# Altium project E-Last.PrjPcb
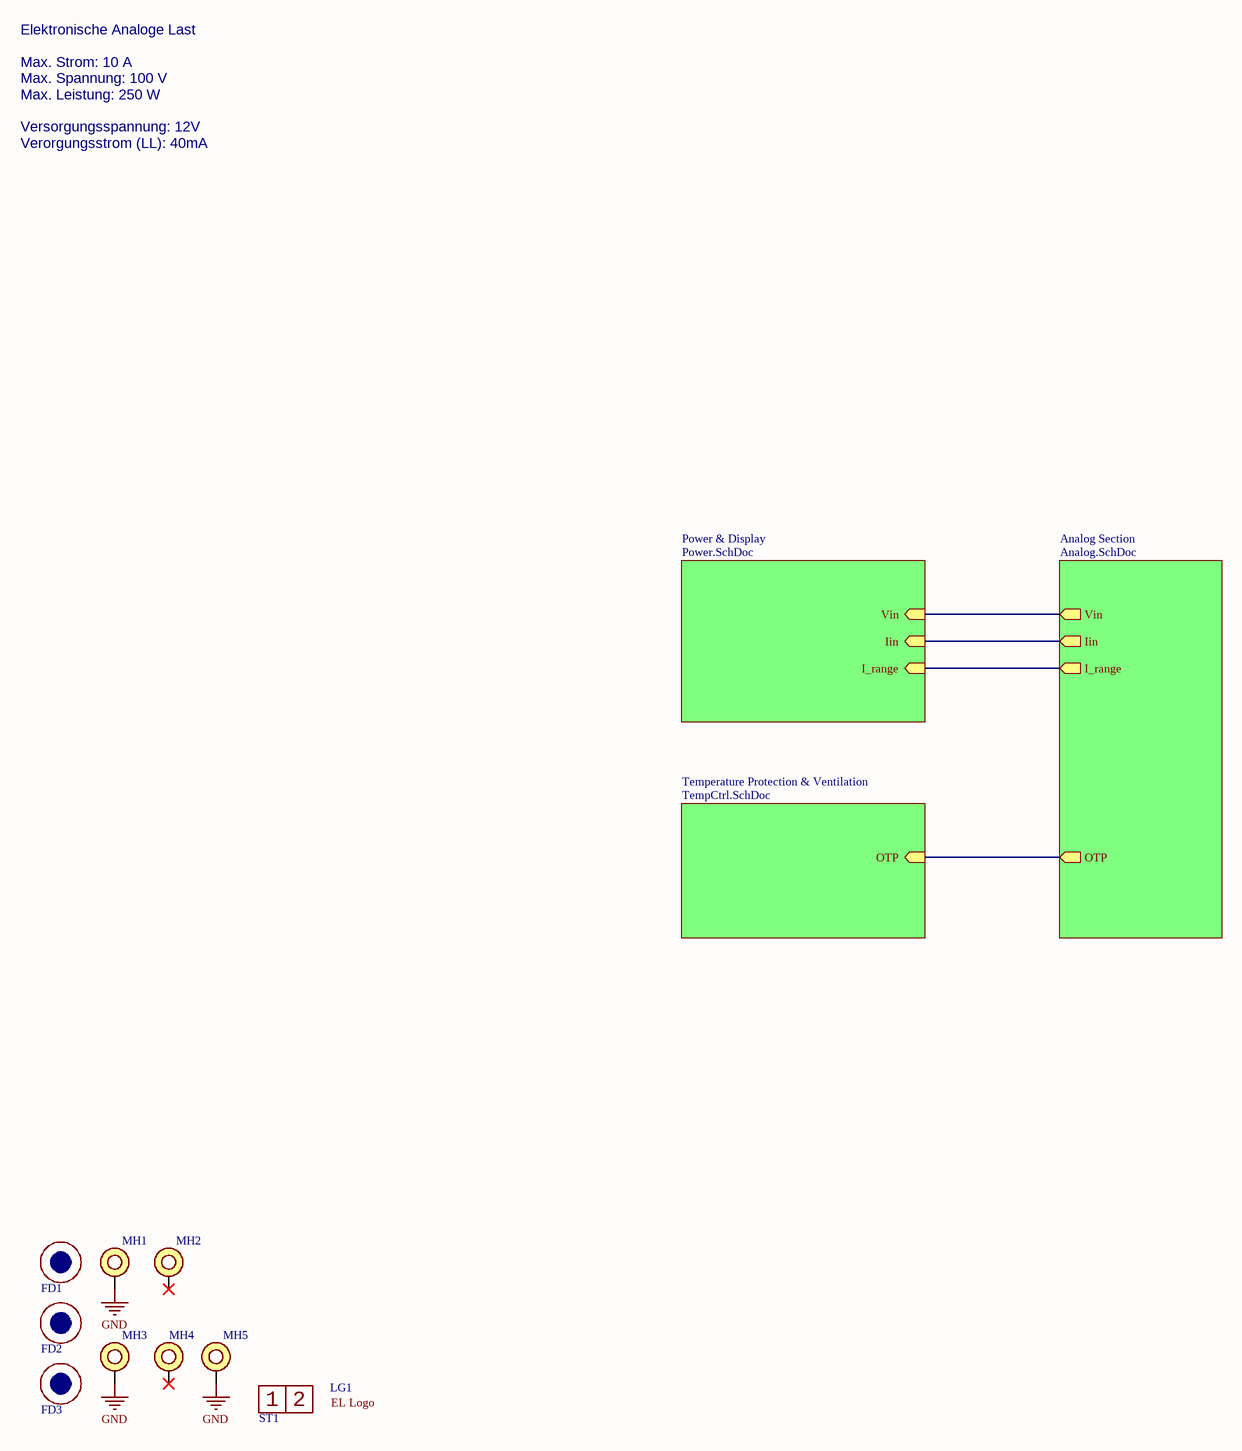
[diagram p0: Main.SchDoc]
Designer: ElektronikLabor; PCBDate: 16.12.2019; Revision: 1.1; SchematicDate: 16.12.2019; SheetTotal: 4; Title: E-Last
4 sheets, 168 parts. Net scope: hierarchical (ports join the sheet entries above them; power ports are global).
Sheets:
  Main.SchDoc
    Power & Display = Power.SchDoc
    Analog Section = Analog.SchDoc
    Temperature Protection & Ventilation = TempCtrl.SchDoc

## Sheet Main.SchDoc: E-Last
size A3; Organization: ElektronikLabor; Revision: 1.1; SheetNumber: 1; SheetTotal: 4; Designer: ElektronikLabor; SchematicDate: 16.12.2019; SheetName: Overview

### Parts
FD1  Fiducial Mark 1mm  [Mech Fiducial 1mm]  (value not drawn)  (no BOM)
FD2  Fiducial Mark 1mm  [Mech Fiducial 1mm]  (value not drawn)  (no BOM)
FD3  Fiducial Mark 1mm  [Mech Fiducial 1mm]  (value not drawn)  (no BOM)
LG1  EL Logo  [Mech Logo EL]  (no BOM)
MH1  3.4mm  [Mech Hole 3.4mm Plated & Restring]  (value not drawn)  (no BOM)
MH2  3.4mm  [Mech Hole 3.4mm Plated & Restring]  (value not drawn)  (no BOM)
MH3  3.4mm  [Mech Hole 3.4mm Plated & Restring]  (value not drawn)  (no BOM)
MH4  3.4mm  [Mech Hole 3.4mm Plated & Restring]  (value not drawn)  (no BOM)
MH5  3.4mm  [Mech Hole 3.4mm Plated & Restring]  (value not drawn)  (no BOM)
ST1  Layer Window 2  [Mech Layer Count 2]  (value not drawn)  (no BOM)

### Sub-sheets
Analog Section = Analog.SchDoc: I_range (out), Iin (out), Vin (out), OTP (out)
Power & Display = Power.SchDoc: I_range (in), Iin (in), Vin (in)
Temperature Protection & Ventilation = TempCtrl.SchDoc: OTP (in)

### Nets
GND: MH1.1 MH3.1 MH5.1
OTP: sheet Analog Section/OTP, sheet Temperature Protection & Ventilation/OTP
Vin: sheet Power & Display/Vin, sheet Analog Section/Vin
NetIC4_1: sheet Power & Display/Iin, sheet Analog Section/Iin
NetQ4_1: sheet Power & Display/I_range, sheet Analog Section/I_range

Not connected (* = marked no-connect by the designer): FD1 0; FD2 0; FD3 0; MH2 1*; MH4 1*

### Notes on the sheet
- Elektronische Analoge Last
  Max. Strom:	10	A
  Max. Spannung:	100	V
  Max. Leistung:	250	W
  Versorgungsspannung:	12V
  Verorgungsstrom (LL):	40mA
- Size:
- Date:
- Designer:
- A3
- Number:
- Revision:
- Page
- of
- Title:
- File:
- Sheet:
- (in symbol Mech Layer Count 2) 1; 2

### Library data of the parts
FD1-FD3 = Mech Fiducial: Mech Fiducial Mark 1mm; Value: Fiducial Mark 1mm
LG1 = Mech Logo EL: Mech Logo EL Top Layer; Value: EL Logo
MH1-MH5 = Mech Hole 3.4mm Pltd Restring 7mm: Mech Hole 3.4mm for M3 Plated & Restring; Value: 3.4mm
ST1 = Mech Layer Count 2: Mech Layer Count 2 Layers; Value: Layer Window 2

## Sheet Power.SchDoc: E-Last
size A3; Organization: ElektronikLabor; Revision: 1.1; SheetNumber: 2; SheetTotal: 4; Designer: ElektronikLabor; SchematicDate: 16.12.2019; SheetName: Power & Display
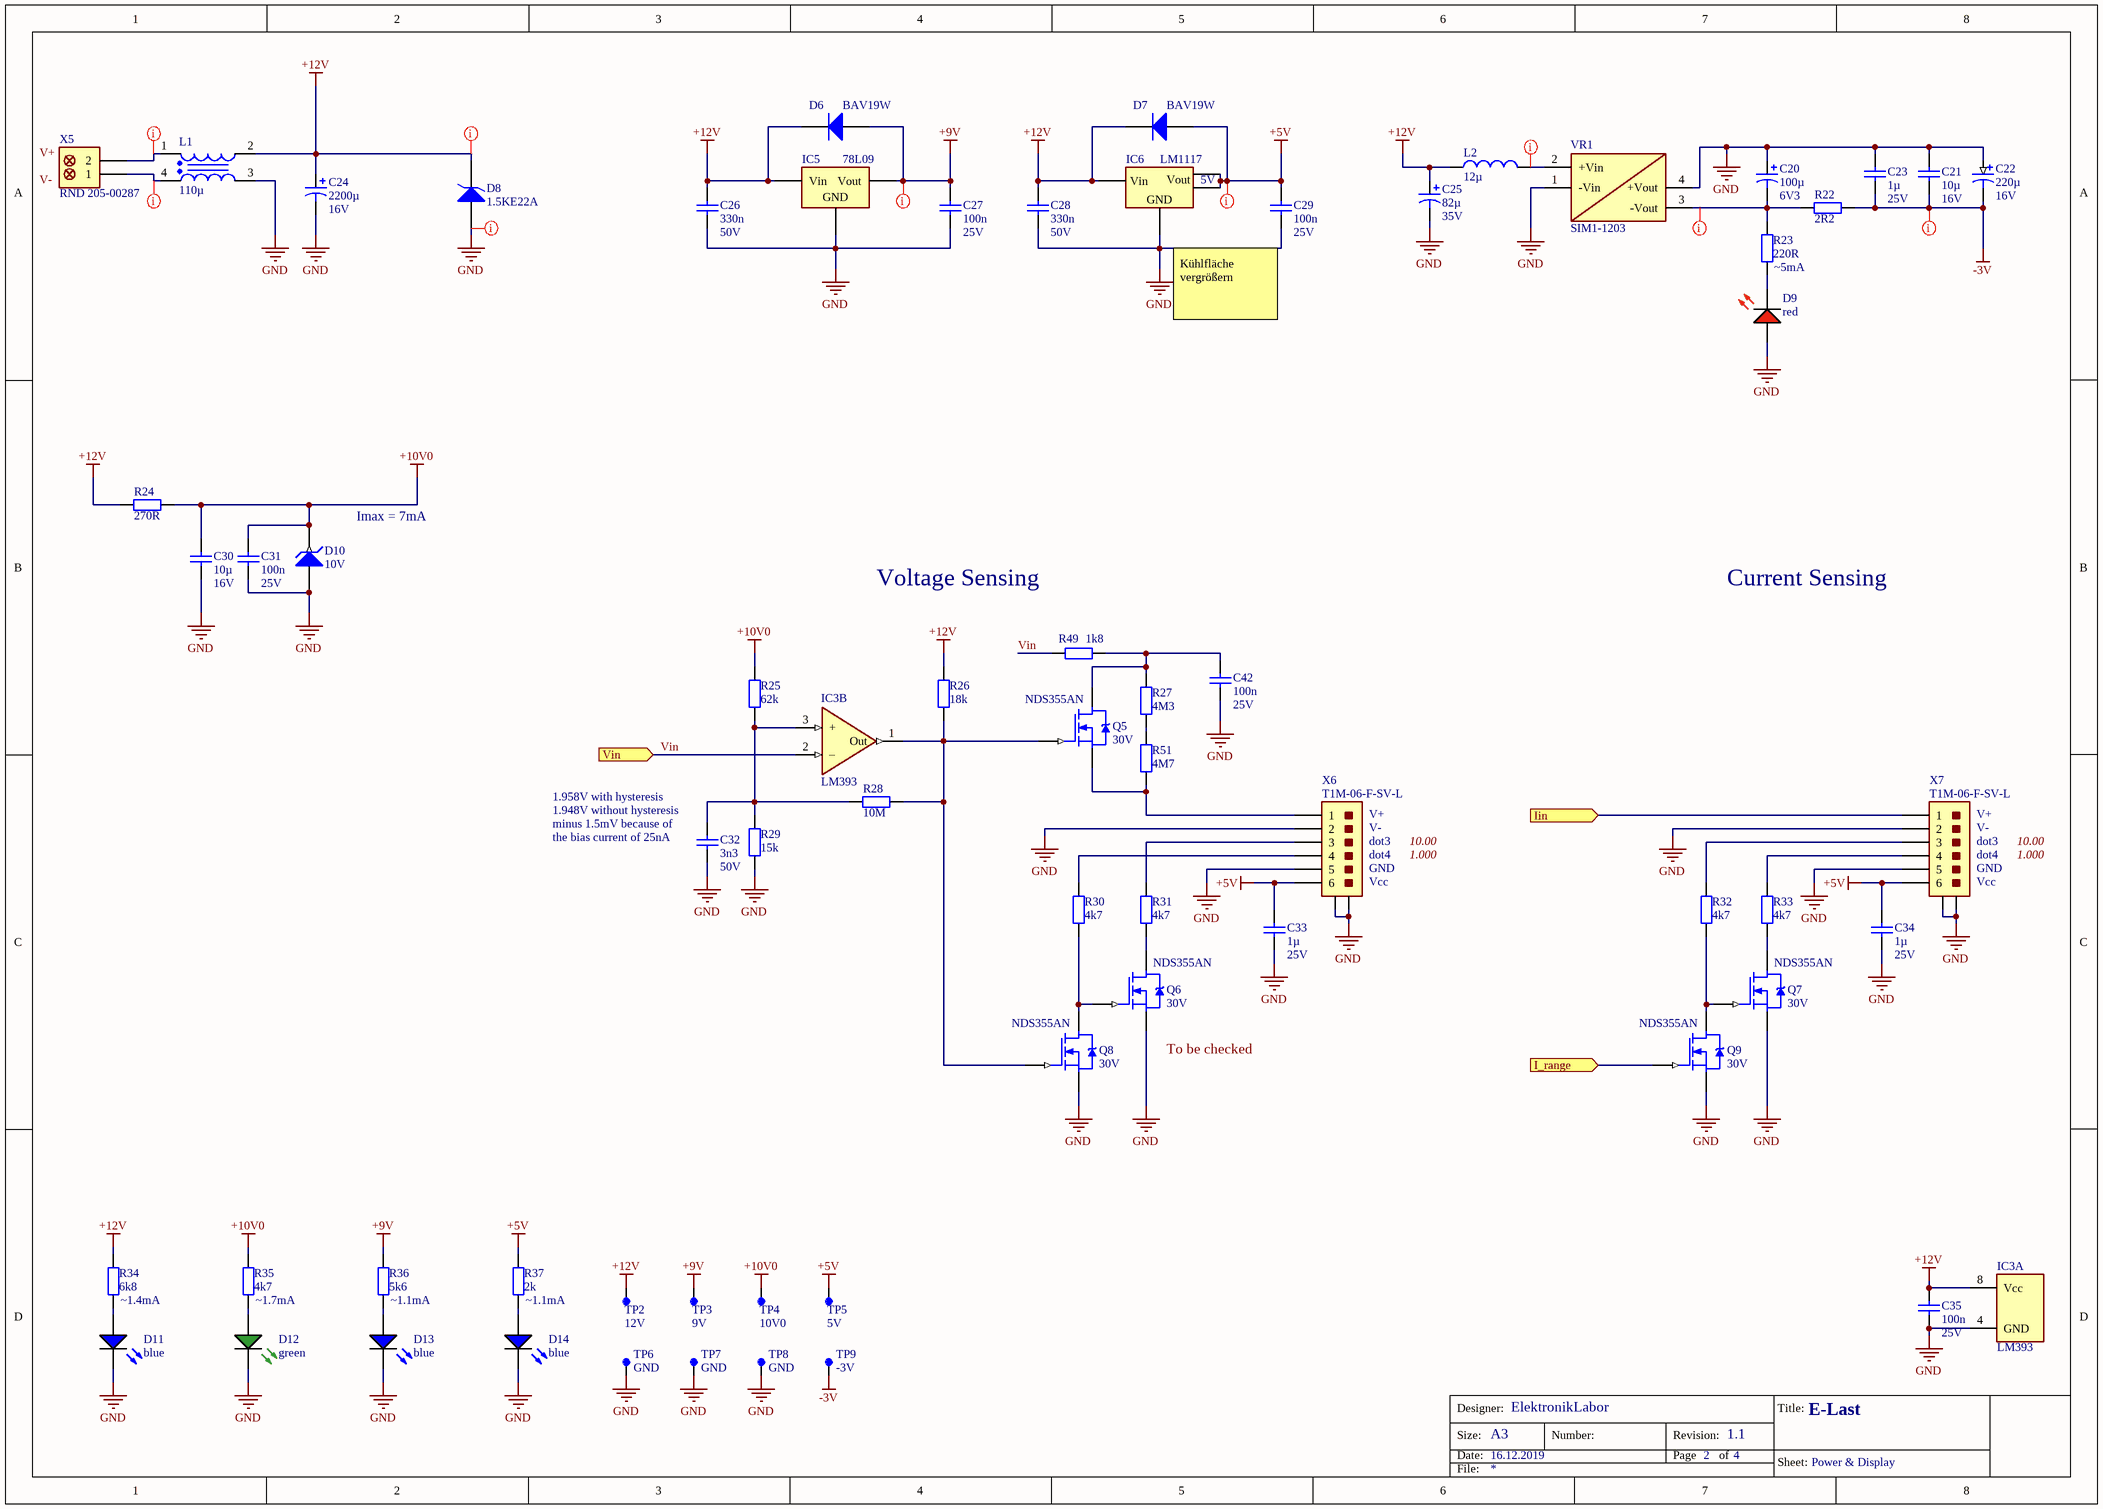
[diagram p1: Power.SchDoc]

### Parts
C20  100µ  Voltage: 6V3  [Cap ELCO 6.3x6 mm]
C21  10µ  Voltage: 16V  [C_1206]
C22  220µ  Voltage: 16V  [Cap Tantal E (2917)]
C23  1µ  Voltage: 25V  [C_0805]
C24  2200µ  Voltage: 16V  [Cap ELCO 12.5x20 mm]
C25  82µ  Voltage: 35V  [Cap ELCO 6.3x15 mm]
C26  330n  Voltage: 50V  [C_0805]
C27  100n  Voltage: 25V  [C_0805]
C28  330n  Voltage: 50V  [C_0805]
C29  100n  Voltage: 25V  [C_0805]
C30  10µ  Voltage: 16V  [C_1206]
C31  100n  Voltage: 25V  [C_0805]
C32  3n3  Voltage: 50V  [C_0805]
C33  1µ  Voltage: 25V  [C_0805]
C34  1µ  Voltage: 25V  [C_0805]
C35  100n  Voltage: 25V  [C_0805]
C42  100n  Voltage: 25V  [C_0805]
D6  BAV19W  [SOD-123]
D7  BAV19W  [SOD-123]
D8  1.5KE22A  [DO-201AD Vert]
D9  red  [LED 0805 SMD WL-SMCW]
D10  10V  [SOT23_N]
D11  blue  [LED 0805 SMD WL-SMCW]
D12  green  [LED 0805 SMD WL-SMCW]
D13  blue  [LED 0805 SMD WL-SMCW]
D14  blue  [LED 0805 SMD WL-SMCW]
IC3  LM393  [SOIC8_N]  (parts A,B of 3)
IC5  78L09  [TO-92A]
IC6  LM1117  Voltage: 5V  [SOT-223]
L1  110µ  [CMC WE-CMB Type S]
L2  12µ  [WE-GFH 4532]
Q5  NDS355AN  Voltage: 30V  [SOT23_N - n-MOS]
Q6  NDS355AN  Voltage: 30V  [SOT23_N - n-MOS]
Q7  NDS355AN  Voltage: 30V  [SOT23_N - n-MOS]
Q8  NDS355AN  Voltage: 30V  [SOT23_N - n-MOS]
Q9  NDS355AN  Voltage: 30V  [SOT23_N - n-MOS]
R22  2R2  [Res 0805]
R23  220R  [Res 0805]
R24  270R  [Res 0805]
R25  62k  [Res 0805]
R26  18k  [Res 0805]
R27  4M3  [Res 0805]
R28  10M  [Res 0805]
R29  15k  [Res 0805]
R30  4k7  [Res 0805]
R31  4k7  [Res 0805]
R32  4k7  [Res 0805]
R33  4k7  [Res 0805]
R34  6k8  [Res 0805]
R35  4k7  [Res 0805]
R36  5k6  [Res 0805]
R37  2k  [Res 0805]
R49  1k8  [Res 0805]
R51  4M7  [Res 0805]
TP2  12V  [Test Point SMD Rnd 1mm]  (no BOM)
TP3  9V  [Test Point SMD Rnd 1mm]  (no BOM)
TP4  10V0  [Test Point SMD Rnd 1mm]  (no BOM)
TP5  5V  [Test Point SMD Rnd 1mm]  (no BOM)
TP6  GND  [Test Point SMD Rnd 1mm]  (no BOM)
TP7  GND  [Test Point SMD Rnd 1mm]  (no BOM)
TP8  GND  [Test Point SMD Rnd 1mm]  (no BOM)
TP9  -3V  [Test Point SMD Rnd 1mm]  (no BOM)
VR1  SIM1-1203  [SIL-4]
X5  RND 205-00287  [TRMNL 5.08mm 2x]
X6  T1M-06-F-SV-L  [T1M-06-XX-S-V]
X7  T1M-06-F-SV-L  [T1M-06-XX-S-V]

### Ports
I_range (in), Iin (in), Vin (in)

### Nets
+5V: C29.1 C33.1 C34.1 D7.1(A) IC6.2(Vout) IC6.4(Vout) R37.1 TP5.1 X6.6 X7.6
+9V: C27.1 D6.1(A) IC5.1(Vout) R36.1 TP3.1
+10V0: C30.1 C31.1 D10.1(K) R24.2 R25.1 R35.1 TP4.1
+12V: C24.1 C25.1 C26.1 C28.1 C35.1 D6.2(K) D7.2(K) D8.K IC3.8(Vcc) IC5.3(Vin) IC6.3(Vin) L1.2 L2.1 R24.1 R26.1 R34.1 TP2.1
-3V: C21.2 C22.2 C23.2 R22.2 TP9.1
GND: C20.1 C21.1 C22.1 C23.1 C24.2 C25.2 C26.2 C27.2 C28.2 C29.2 C30.2 C31.2 C32.2 C33.2 C34.2 C35.2 C42.2 D8.A D9.2(A) D10.2(A) D11.1(K) D12.1(K) D13.1(K) D14.1(K) IC3.4(GND) IC5.2(GND) IC6.1(GND) L1.3 Q6.2(S) Q7.2(S) Q8.2(S) Q9.2(S) R29.2 TP6.1 TP7.1 TP8.1 VR1.1(-Vin) VR1.4(+Vout) X6.2 X6.5 X6.7(CASE) X6.8(CASE) X7.2 X7.5 X7.7(CASE) X7.8(CASE)
Vin: IC3.2(–) R49.2 ; port Vin
NetC20_2: C20.2 R22.1 R23.1 VR1.3(-Vout)
NetC32_1: C32.1 IC3.3(+) R25.2 R28.1 R29.1
NetC42_1: C42.1 Q5.3(D) R27.2 R49.1
NetD9_1: D9.1(K) R23.2
NetD11_2: D11.2(A) R34.2
NetD12_2: D12.2(A) R35.2
NetD13_2: D13.2(A) R36.2
NetD14_2: D14.2(A) R37.2
NetIC3_1: IC3.1(Out) Q5.1(G) Q8.1(G) R26.2 R28.2
NetIC4_1: X7.1 ; port Iin
NetL1_1: L1.1 X5.2
NetL1_4: L1.4 X5.1
NetL2_2: L2.2 VR1.2(+Vin)
NetQ4_1: Q9.1(G) ; port I_range
NetQ5_2: Q5.2(S) R51.2 X6.1
NetQ6_1: Q6.1(G) Q8.3(D) R30.2
NetQ6_3: Q6.3(D) R31.2
NetQ7_1: Q7.1(G) Q9.3(D) R32.2
NetQ7_3: Q7.3(D) R33.1
NetR27_1: R27.1 R51.1
NetR30_1: R30.1 X6.4
NetR31_1: R31.1 X6.3
NetR32_1: R32.1 X7.3
NetR33_2: R33.2 X7.4

### Layout directives
rule Width Constraint [Pref Width = 2mm    Min Width = 2mm    Max Width = 3mm]: NetL1_1, NetL1_4
rule Width Constraint [Pref Width = 1mm    Min Width = 0.5mm    Max Width = 2mm]: +5V, +9V
rule Width Constraint [Pref Width = 1mm    Min Width = 0.75mm    Max Width = 2mm]: NetC20_2
rule Width Constraint [Pref Width = 2mm    Min Width = 0.5mm    Max Width = 2mm]: -3V
rule Width Constraint [Pref Width = 2mm    Min Width = 0.5mm    Max Width = 3mm]; rule Clearance Constraint [Clearance = 0.3mm]: +12V
rule Width Constraint [Pref Width = 1mm    Min Width = 0.5mm    Max Width = 5mm]: GND
rule Width Constraint [Pref Width = 2mm    Min Width = 1mm    Max Width = 2mm]: NetL2_2

### Notes on the sheet
- (near X5) V+
- (near X5) V-
- Kühlfläche vergrößern
- (near R23) ~5mA
- Imax = 7mA
- Voltage Sensing
- Current Sensing
- (near C32) 1.958V with hysteresis
  1.948V without hysteresis
  minus 1.5mV because of
  the bias current of 25nA
- (near X6) V+
- (near X6) V-
- (near X6) dot3
- (near X6) dot4
- 1.000
- 10.00
- (near X7) V+
- (near X7) V-
- (near X7) dot3
- (near X7) dot4
- (near X6) GND
- (near X6) Vcc
- (near X7) GND
- (near X7) Vcc
- (near Q6) To be checked
- (near R34) ~1.4mA
- (near R35) ~1.7mA
- (near R36) ~1.1mA
- (near R37) ~1.1mA
- Size:
- Date:
- Designer:
- A3
- Number:
- Revision:
- Page
- of
- Title:
- File:
- Sheet:

### Library data of the parts
C20 = Cap Pol2 100µ: Cap Elco 100µ Radial; Manufacturer: Nichicon; PartNumber: UMA0J101MDD; Other: Available; Value: 100µ; ComponentLink1Description: Datasheet; ComponentLink1URL: G:\Daten\Datenblätter\Kondensatoren\Nichicon_UMA.pdf
C21 C30 = C-Cer 1206 16V 10µ: Cap Ceramic 1206 10µ 16V; PartNumber: CL31B106MOHNNNE; Manufacturer: Samsung; Temp. Coeff.: X7R; PackageReference: C1206; PackageDescription: Chip Capacitor; Value: 10µ; Supplier 1: Digi-Key; Supplier Part Number 1: 1276-6641-1-ND; Price [€]: 0,13
C22 = Cap Tantal 220µ: Cap Tantal 220µ 16V SMD; Manufacturer: AVX; PartNumber: TPSE227*016#0100; Value: 220µ; ComponentLink1Description: Datasheet; ComponentLink1URL: G:\Daten\Datenblätter\Kondensatoren\AVX_Tantal_TPS.pdf; Supplier Part Number 1: TPS 7343 220/16; Supplier 1: Reichelt; Price [€]: 1,15
C23 C33 C34 = C-Cer 0805 1µ: Cap Ceramic 0805 1µ 25V; Manufacturer: Samsung; PartNumber: CL21B105KAFNNNE; Temp. Coeff.: X7R; Tolerance: 10%; PackageReference: C0805; PackageDescription: Chip Capacitor; Value: 1µ; Supplier 1: Digi-Key; Supplier Part Number 1: 1276-1066-1-ND
C24 = Cap Pol 2200µ 16V: Cap Elco 2200µ 16V THT Radial; Manufacturer: Rubycon; PartNumber: UFW1C222MHD; Value: 2200µ; ComponentLink1Description: Datasheet; ComponentLink1URL: G:\Daten\Datenblätter\Kondensatoren\Nichicon_UFW.pdf; Supplier 1: Digi-Key; Supplier Part Number 1: 493-15122-ND; Price [€]: 0.77
C25 = Cap Pol2 82µ: Cap Elco 82µ Radial; Manufacturer: Nippon Chemi-Con; PartNumber: ELXY350ETD820MF15D; Other: Available; Value: 82µ; ComponentLink1Description: Datasheet; ComponentLink1URL: G:\Daten\Datenblätter\Kondensatoren\Chemi-Con_LXY.pdf
C26 C28 = C-Cer 0805 330n: Cap Ceramic 0805 330n 50V; Manufacturer: Samsung; PartNumber: CL21B334KBFNNNE; Temp. Coeff.: X7R; Tolerance: 10%; PackageReference: C0805; PackageDescription: Chip Capacitor; Value: 330n; Price [€]: 0,18; Supplier 1: Digi-Key; Supplier Part Number 1: 1276-1123-1-ND
C27 C29 C31 C35 C42 = C-Cer 0805 100n: Cap Ceramic 0805 100n 25V; Manufacturer: generic; Temp. Coeff.: X7R; PackageReference: C_0805; PackageDescription: Chip Capacitor; Value: 100n; PartNumber: generic
C32 = C-Cer 0805 3n3: Cap Ceramic 0805 3n3 50V; Manufacturer: generic; Temp. Coeff.: X7R; PackageReference: C0805; PackageDescription: Chip Capacitor; Value: 3n3; PartNumber: generic
D6 D7 = Diode BAV19W: Diode, Fast, 400mA, SOD-123, SMD; Manufacturer: Diodes; PartNumber: BAV19W-E3-08; Notes: Available; Voltage: 150V; ComponentLink1Description: Datasheet; ComponentLink1URL: G:\Daten\Datenblätter\Dioden\BAV19W.pdf; Current: 400mA; Value: BAV19W
D8 = Diode 1.5KE22A: Diode, TVS, Uni, 22V, CB429, THT; Manufacturer: ST; Current: 49A; Voltage: 18.8V; Power: 1.5kW; ComponentLink1Description: Datasheet; ComponentLink1URL: G:\Daten\Datenblätter\Dioden\1_5KE22A_TVS.pdf; PartNumber: 1.5KE22A; Value: 1.5KE22A; Supplier 1: Reichelt; Supplier Part Number 1: 1,5KE 22A
D9 = LED Red 0805 SMD: Manufacturer: Würth Elektronik; PartNumber: 150080SS75000; Voltage: 1.9V; Current: 30mA; Color: red; ComponentLink1Description: Datasheet; ComponentLink1URL: G:\Daten\Datenblätter\LED\0805_red_150080SS75000.pdf; Supplier 1: Digi-Key; Supplier Part Number 1: 732-4985-1-ND; Price [€]: 0,18
D10 = V-Ref LM4040AIM3-10.0: PartNumber: LM4040AIM3-10.0/NOPB; Manufacturer: Texas Instruments; Current: 5mA; Value: 10V; Supplier 1: Digi-Key; Price [€]: 1,53; ComponentLink1Description: Datasheet; ComponentLink1URL: G:\Daten\Datenblätter\Spg.-Referenz\TI_LM4040-N.pdf; Supplier Part Number 1: LM4040AIM3-10.0/NOPBCT-ND
D11 D13 D14 = LED Blue 0805 SMD: Manufacturer: Würth Elektronik; PartNumber: 150080BS75000; Voltage: 3.2V; Current: 30mA; Color: blue; ComponentLink1Description: Datasheet; ComponentLink1URL: G:\Daten\Datenblätter\LED\0805_blue_150080BS75000.pdf; Supplier 1: Digi-Key; Supplier Part Number 1: 732-4982-1-ND; Price [€]: 0,18
D12 = LED Green 0805 SMD: PartNumber: Generic; Voltage: 1.886V; Other: Available; Color: green; Manufacturer: Generic
IC3 = LM393DT: Comparator LM393DT 2x; Manufacturer: ST; Manufacturer_B: ROHM; Value: LM393; PartNumber: LM393DT; Price [€]: 0,44; ComponentLink1Description: Datasheet; ComponentLink1URL: G:\Daten\Datenblätter\Komparatoren\ST_LM393.pdf; Supplier 1: Digi-Key; Supplier Part Number 1: 497-1593-1-ND; PartNumber_B: LM393DT
IC5 = Volt Reg 78L09 TO92: Voltage Regulator 9V; Manufacturer: ST; PartNumber: L78L09ACZ; Current: 100mA; Other: Available; Value: 78L09; ComponentLink1Description: Datasheet; ComponentLink1URL: G:\Daten\Datenblätter\Spannungsregler\78L09_ST.pdf; Voltage: 9V
IC6 = Volt Reg LM1117MPX-5.0 SOT-223: Voltage Regulator 5V SOT-223; Manufacturer: Texas Instruments; PartNumber: L7805CV; Current: 800mA; Other: Available; ComponentLink1Description: Datasheet; ComponentLink1URL: G:\Daten\Datenblätter\Spannungsregler\LM1117.pdf; Value: LM1117; ComponentLink2URL: https://www.reichelt.de/ICs-LM-1000-LM-1999/LM-1117-MPX-5-0/3/index.html?ACTION=3&GROUPID=5465&ARTICLE=187609&OFFSET=75&; ComponentLink2Description: Supplier; Supplier Part Number 1: LM 1117 MPX-5.0; Supplier 1: Reichelt
L1 = CMC 110µ: Common Mode Choke, WE-CMB Type S, 110 uH; Manufacturer: Würth Elektronik; PartNumber: 744842311; RatedCurrent: 3A; Other: Available; PublishedDate: Nov. 2016; ComponentLink1Description: Manufacturer; ComponentLink1URL: http://www.we-online.de; ComponentLink2Description: Datasheet; ComponentLink2URL: http://katalog.we-online.de/pbs/datasheet/744842311.pdf; Size: Type S; Value: 110µ
L2 = Inductor 12µ: Inductor 12µ 7447669112 SMD; Manufacturer: Würth Elektronik; Current: 810mA; Value: 12µ; PartNumber: 7447669112; Price [€]: 0,43; ComponentLink1Description: Datasheet; ComponentLink1URL: G:\Daten\Datenblätter\Inductors\WE_7447669112_12µ.pdf; Supplier 1: Digi-Key; Supplier Part Number 1: 732-7321-1-ND
Q5-Q9 = Transistor n-MOS NDS355AN: Transistor n-MOS SOT-23 30V Vgs=20V; Manufacturer: ON Semiconductor; Note: Vgs_max = 20V; Current: 1.7A; PackageDescription: SOT-23; ComponentLink1Description: Datasheet; ComponentLink1URL: G:\Daten\Datenblätter\Transistoren\nMOS_NDS355AN.pdf; PartNumber: NDS355AN; Supplier 1: Digi-Key; Supplier Part Number 1: NDS355ANCT-ND; Price [€]: 0,39
R22 = Res 0805 2R2: Resistor 0805 2R2; Manufacturer: generic; Power: 0.125W; PartNumber: generic; Value: 2R2
R23 = Res 0805 220R: Resistor 0805 220R; Manufacturer: generic; Power: 0.125W; PartNumber: generic; Value: 220R
R24 = Res 0805 270R: Resistor 0805 270R; Manufacturer: generic; Power: 0.125W; PartNumber: generic; Value: 270R
R25 = Res 0805 62k: Resistor 0805 62k; Manufacturer: generic; Power: 0.125W; PartNumber: generic; Value: 62k
R26 = Res 0805 18k: Resistor 0805 18k; Manufacturer: generic; Power: 0.125W; PartNumber: generic; Value: 18k
R27 = Res 0805 4M3: Resistor 0805 4M3; Manufacturer: generic; Power: 0.125W; PartNumber: generic; Value: 4M3
R28 = Res 0805 10M: Resistor 0805 10M; Manufacturer: generic; Power: 0.125W; PartNumber: generic; Value: 10M
R29 = Res 0805 15k: Resistor 0805 15k; Manufacturer: generic; Power: 0.125W; PartNumber: generic; Value: 15k
R30-R33 R35 = Res 0805 4k7: Resistor 0805 4k7; Manufacturer: generic; Power: 0.125W; PartNumber: generic; Value: 4k7
R34 = Res 0805 6k8: Resistor 0805 6k8; Manufacturer: generic; Power: 0.125W; PartNumber: generic; Value: 6k8
R36 = Res 0805 5k6: Resistor 0805 5k6; Manufacturer: generic; Power: 0.125W; PartNumber: generic; Value: 5k6
R37 = Res 0805 2k: Resistor 0805 2k; Manufacturer: generic; Power: 0.125W; PartNumber: generic; Value: 2k
R49 = Res 0805 1k8: Resistor 0805 1k8; Manufacturer: generic; Power: 0.125W; PartNumber: generic; Value: 1k8
R51 = Res 0805 4M7: Resistor 0805 4M7; Manufacturer: generic; Power: 0.125W; PartNumber: generic; Value: 4M7
TP2-TP9 = Test Point
  TP2: SilkScreen: 12V
  TP3: SilkScreen: 9V
  TP4: SilkScreen: 10V0
  TP5: SilkScreen: 5V
  TP6-TP8: SilkScreen: GND
  TP9: SilkScreen: -3V
VR1 = DC/DC SIM1-1203: DC/DC Converter Isolated 3V; Manufacturer: HN Electronic Components; PartNumber: SIM1-1203-SIL4; Current: 300mA; Other: Available; ComponentLink1Description: Datasheet; ComponentLink1URL: G:\Daten\Datenblätter\DCDC_Converter\SIM1_1203.pdf; Voltage: 3V; Value: SIM1-1203
X5 = Termial 2pin 5.08mm: Terminal, 2-Pin, 5.08mm, THT; Manufacturer: RND connect; Current: 20A; ComponentLink1Description: Reichelt URL; ComponentLink1URL: https://www.reichelt.de/RND-connect/RND-205-00287/3/index.html?ACTION=3&GROUPID=7552&ARTICLE=170288&OFFSET=16&; PartNumber: RND 205-00287; ComponentLink2Description: Datasheet; ComponentLink2URL: G:\Daten\Datenblätter\Verbinder\Terminal_RND_205-00287.pdf; Price [€]: 0,41; Supplier 1: Reichelt; Supplier Part Number 1: RND 205-00287
X6 X7 = Con Male 6-Pin: Connector, Male, Vertical, 6-Pin, 1mm, SMD; Manufacturer: SAMTEC; MatingPartNumber: S1SS-06-L; PartNumber: T1M-06-F-SV-L; Value: T1M-06-F-SV-L; Supplier Part Number 1: T1M-06-F-SV-L; Supplier 1: SAMTEC; ComponentLink1Description: Datasheet; ComponentLink1URL: G:\Daten\Datenblätter\Steckverbinder\T1M-Single-Row.pdf

## Sheet Analog.SchDoc: E-Last
size A3; Date: 16.12.2019; Organization: ElektronikLabor; Revision: 1.1; SheetNumber: 3; SheetTotal: 4; Designer: ElektronikLabor; SchematicDate: 16.12.2019; SheetName: Input & Voltage Sensing
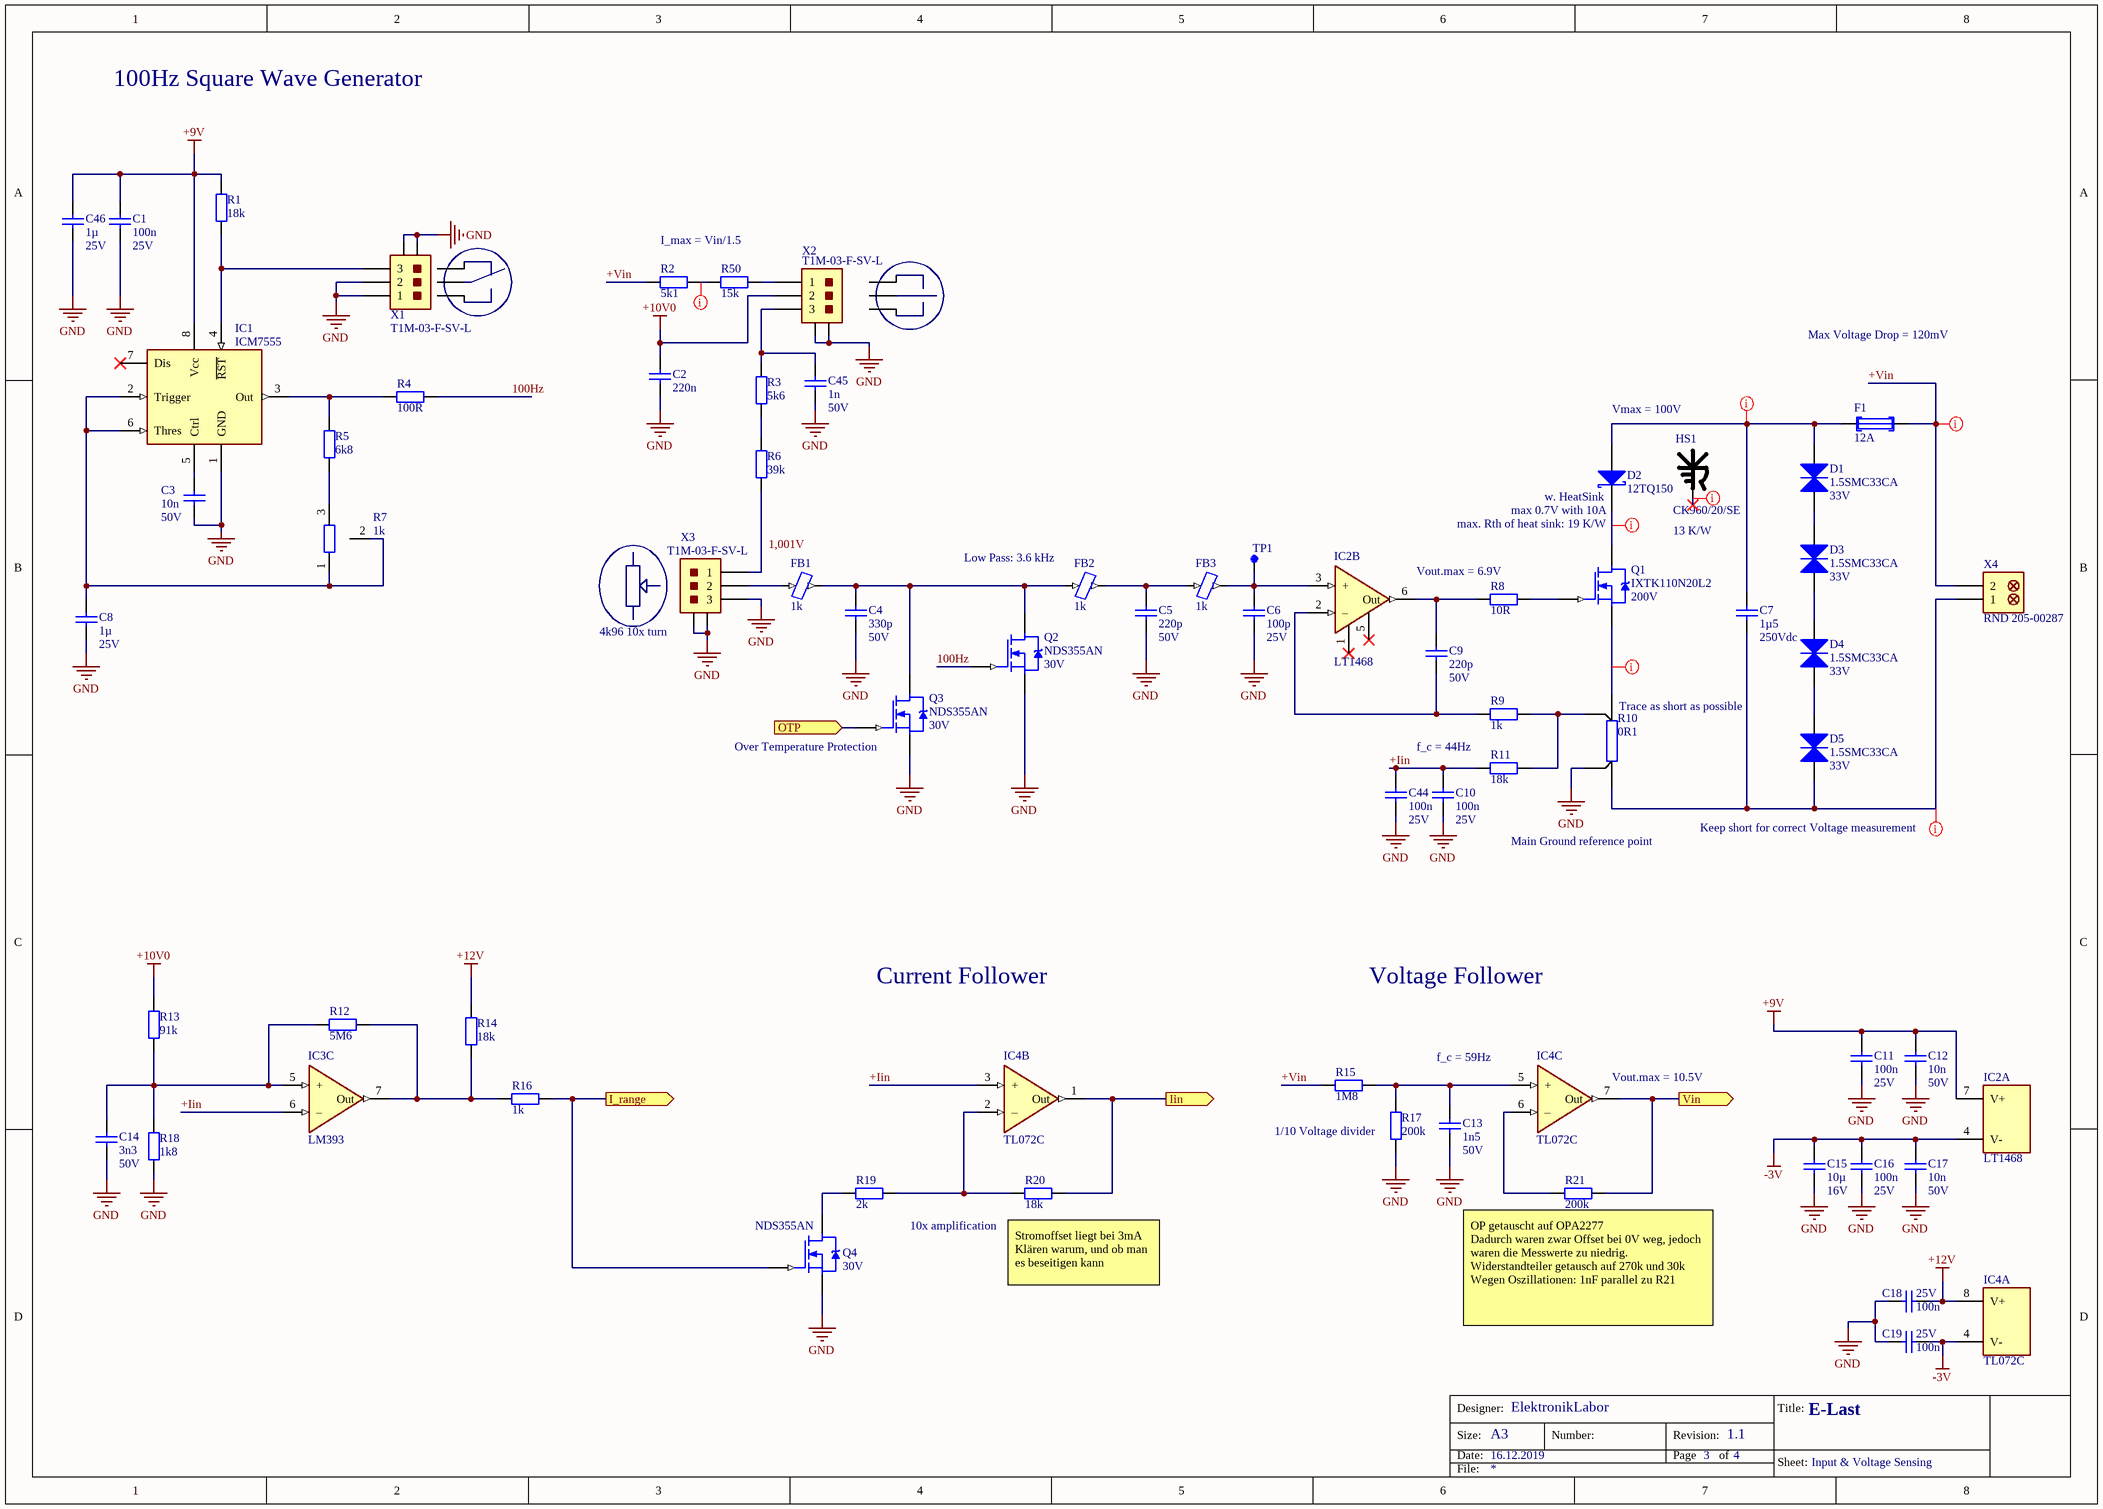
[diagram p2: Analog.SchDoc]

### Parts
C1  100n  Voltage: 25V  [C_0805]
C2  220n  [C_0805]
C3  10n  Voltage: 50V  [C_0805]
C4  330p  Voltage: 50V  [C_0805]
C5  220p  Voltage: 50V  [C_0805]
C6  100p  Voltage: 25V  [C_0805]
C7  1µ5  Voltage: 250Vdc  [Cap Film 15mm THT]
C8  1µ  Voltage: 25V  [C_0805]
C9  220p  Voltage: 50V  [C_0805]
C10  100n  Voltage: 25V  [C_0805]
C11  100n  Voltage: 25V  [C_0805]
C12  10n  Voltage: 50V  [C_0805]
C13  1n5  Voltage: 50V  [C_0805]
C14  3n3  Voltage: 50V  [C_0805]
C15  10µ  Voltage: 16V  [C_1206]
C16  100n  Voltage: 25V  [C_0805]
C17  10n  Voltage: 50V  [C_0805]
C18  100n  Voltage: 25V  [C_0805]
C19  100n  Voltage: 25V  [C_0805]
C44  100n  Voltage: 25V  [C_0805]
C45  1n  Voltage: 50V  [C_0805]
C46  1µ  Voltage: 25V  [C_0805]
D1  1.5SMC33CA  Voltage: 33V  [DO-214AB]
D2  12TQ150  [TO-220-2 Vertical]
D3  1.5SMC33CA  Voltage: 33V  [DO-214AB]
D4  1.5SMC33CA  Voltage: 33V  [DO-214AB]
D5  1.5SMC33CA  Voltage: 33V  [DO-214AB]
F1  12A  [Fuse w Holder 5x20mm 25mm]
FB1  1k  [Ferrite 0805]
FB2  1k  [Ferrite 0805]
FB3  1k  [Ferrite 0805]
HS1  CK960/20/SE  [Mech Heat Sink CK960/20/SE]
IC1  ICM7555  [SOIC8_N]
IC2  LT1468  [SOIC8_N]  (parts A,B of 2)
IC3  LM393  [SOIC8_N]  (part C of 3)
IC4  TL072C  [SOIC8_N]  (parts A,B,C of 3)
Q1  IXTK110N20L2  Voltage: 200V  [TO-264-3 vertical]
Q2  NDS355AN  Voltage: 30V  [SOT23_N - n-MOS]
Q3  NDS355AN  Voltage: 30V  [SOT23_N - n-MOS]
Q4  NDS355AN  Voltage: 30V  [SOT23_N - n-MOS]
R1  18k  [Res 0805]
R2  5k1  [Res 0805]
R3  5k6  [Res 0805]
R4  100R  [Res 0805]
R5  6k8  [Res 0805]
R6  39k  [Res 0805]
R7  1k  [Poti 3296Y]
R8  10R  [Res 0805]
R9  1k  [Res 0805]
R10  0R1  [Res 4-SIL]
R11  18k  [Res 0805]
R12  5M6  [Res 0805]
R13  91k  [Res 0805]
R14  18k  [Res 0805]
R15  1M8  [Res 0805]
R16  1k  [Res 0805]
R17  200k  [Res 0805]
R18  1k8  [Res 0805]
R19  2k  [Res 0805]
R20  18k  [Res 0805]
R21  200k  [Res 0805]
R50  15k  [Res 0805]
TP1  *  [Test Point SMD Rnd 1mm]  (value not drawn)  (no BOM)
X1  T1M-03-F-SV-L  [T1M-03-XX-S-V]
X2  T1M-03-F-SV-L  [T1M-03-XX-S-V]
X3  T1M-03-F-SV-L  [T1M-03-XX-S-V]
X4  RND 205-00287  [TRMNL 5.08mm 2x]

### Ports
I_range (out), Iin (out), OTP (in), Vin (out)

### Nets
+9V: C1.1 C11.1 C12.1 C46.1 IC1.8(Vcc) IC2.7(V+) R1.1
+10V0: C2.1 R13.1 X2.2
+12V: C18.2 IC4.8(V+) R14.1
-3V: C15.1 C16.1 C17.1 C19.1 IC2.4(V-) IC4.4(V-)
GND: C1.2 C2.2 C3.2 C4.2 C5.2 C6.2 C8.2 C10.2 C11.2 C12.2 C13.2 C14.2 C15.2 C16.2 C17.2 C18.1 C19.2 C44.2 C45.2 C46.2 IC1.1(GND) Q2.2(S) Q3.2(S) Q4.2(S) R10.3 R17.2 R18.2 X1.1 X1.2 X1.4(CASE) X1.5(CASE) X2.4(CASE) X2.5(CASE) X3.3 X3.4(CASE) X3.5(CASE)
100Hz: Q2.1(G) R4.2
+Iin: C10.1 C44.1 IC3.6(–) IC4.3(+) R11.1
+Vin: F1.2 R2.1 R15.1 X4.2
OTP: Q3.1(G) ; port OTP
Vin: IC4.7(Out) R21.2 ; port Vin
NetC3_1: C3.1 IC1.5(Ctrl)
NetC4_1: C4.1 FB1.2 FB2.1 Q2.3(D) Q3.3(D)
NetC5_1: C5.1 FB2.2 FB3.1
NetC6_1: C6.1 FB3.2 IC2.3(+) TP1.1
NetC7_1: C7.1 D1.1 D2.2(A) F1.1
NetC7_2: C7.2 D5.2 R10.4 X4.1
NetC8_1: C8.1 IC1.2(Trigger) IC1.6(Thres) R7.1 R7.2
NetC9_1: C9.1 IC2.6(Out) R8.1
NetC9_2: C9.2 IC2.2(–) R9.1
NetC13_1: C13.1 IC4.5(+) R15.2 R17.1
NetC14_1: C14.1 IC3.5(+) R12.1 R13.2 R18.1
NetC45_1: C45.1 R3.1 X2.3
NetD1_2: D1.2 D3.1
NetD2_1: D2.1(K) Q1.2(D)
NetD3_2: D3.2 D4.1
NetD4_2: D4.2 D5.1
NetFB1_1: FB1.1 X3.2
NetIC1_3: IC1.3(Out) R4.1 R5.1
NetIC1_4: IC1.4(~{RST}) R1.2 X1.3
NetIC3_7: IC3.7(Out) R12.2 R14.2 R16.1
NetIC4_1: IC4.1(Out) R20.2 ; port Iin
NetIC4_2: IC4.2(–) R19.2 R20.1
NetIC4_6: IC4.6(–) R21.1
NetQ1_1: Q1.1(G) R8.2
NetQ1_3: Q1.3(S) R10.1
NetQ4_1: Q4.1(G) R16.2 ; port I_range
NetQ4_3: Q4.3(D) R19.1
NetR2_2: R2.2 R50.1
NetR3_2: R3.2 R6.1
NetR5_2: R5.2 R7.3
NetR6_2: R6.2 X3.1
NetR9_2: R9.2 R10.2 R11.2
NetR50_2: R50.2 X2.1

Not connected (* = marked no-connect by the designer): HS1 1*; IC1 7(Dis)*; IC2 1(NULL)* 5(NULL)* 8(DNC)

### Layout directives
rule Width Constraint [Pref Width = 5mm    Min Width = 1mm    Max Width = 6mm]; rule Clearance Constraint [Clearance = 0.5mm]; rule Power Plane Clearance [Clearance = 0.5mm]: NetC7_2
rule Width Constraint [Pref Width = 5mm    Min Width = 0.5mm    Max Width = 6mm]; rule Clearance Constraint [Generic clearance = 1.2mm, and 1 value(s) for objects]; rule Power Plane Clearance [Clearance = 1mm]: +Vin
rule Width Constraint [Pref Width = 5mm    Min Width = 3mm    Max Width = 6mm]; rule Clearance Constraint [Clearance = 0.5mm]: NetQ1_3
rule Width Constraint [Pref Width = 196.85mil    Min Width = 118.11mil    Max Width = 236.22mil]; rule Clearance Constraint [Clearance = 0.75mm]: NetD2_1
rule Width Constraint [Pref Width = 5mm    Min Width = 1mm    Max Width = 6mm]; rule Clearance Constraint [Clearance = 0.75mm]: NetC7_1
rule Clearance Constraint [Clearance = 0.75mm]; rule Component Clearance Constraint [Horizontal Clearance = 0mm    Vertical Clearance = 0mm]: NetHS1_1
rule Clearance Constraint [Clearance = 0.5mm]: NetR2_2

### Notes on the sheet
- 100Hz Square Wave Generator
- I_max = Vin/1.5
- Max Voltage Drop = 120mV
- Vmax = 100V
- (near D2) max 0.7V with 10A
- (near D2) w. HeatSink
- 1,001V
- (near FB2) Low Pass: 3.6 kHz
- Vout.max = 6.9V
- max. Rth of heat sink: 19 K/W
- (near HS1) 13 K/W
- (near X3) 4k96 10x turn
- (near R10) Trace as short as possible
- (near Q3) Over Temperature Protection
- f_c = 44Hz
- Main Ground reference point
- Keep short for correct Voltage measurement
- Current Follower
- Voltage Follower
- f_c = 59Hz
- (near IC4) Vout.max = 10.5V
- (near R17) 1/10 Voltage divider
- 10x amplification
- (near R20) Stromoffset liegt bei 3mA
  Klären warum, und ob man es beseitigen kann
- (near R21) OP getauscht auf OPA2277
  Dadurch waren zwar Offset bei 0V weg, jedoch waren die Messwerte zu niedrig.
  Widerstandteiler getausch auf 270k und 30k
  Wegen Oszillationen: 1nF parallel zu R21
- Size:
- Date:
- Designer:
- A3
- Number:
- Revision:
- Page
- of
- Title:
- File:
- Sheet:

### Library data of the parts
C1 C10 C11 C16 C18 C19 C44 = C-Cer 0805 100n: as C27 on sheet Power; PackageReference: C_0805; PackageDescription: Chip Capacitor; Value: 100n; PartNumber: generic
C2 = C-Cer 0805 220n: Cap Ceramic 0805 220n 50V; Manufacturer: generic; Temp. Coeff.: X7R; PackageReference: C0805; PackageDescription: Chip Capacitor; Value: 220n; PartNumber: generic; Voltage: 50V
C3 C12 C17 = C-Cer 0805 10n: Cap Ceramic 0805 10n 50V; Manufacturer: generic; Temp. Coeff.: X7R; PackageReference: C0805; PackageDescription: Chip Capacitor; Value: 10n; PartNumber: generic
C4 = C-Cer 0805 330p: Cap Ceramic 0805 330p 50V; Manufacturer: generic; Temp. Coeff.: X7R; PackageReference: C0805; PackageDescription: Chip Capacitor; Value: 330p; PartNumber: generic; Price [€]: 0,18
C5 C9 = C-Cer 0805 220p: Cap Ceramic 0805 220p 50V; Manufacturer: generic; Temp. Coeff.: X7R; PackageReference: C0805; PackageDescription: Chip Capacitor; Value: 220p; PartNumber: generic
C6 = C-Cer 0805 100p: Cap Ceramic 0805 100p 50V; Manufacturer: generic; Temp. Coeff.: C0G; PackageReference: C0805; PackageDescription: Chip Capacitor; Value: 100p; PartNumber: generic
C7 = Cap-Film 1µ5 250V 15mm: Cap Film 1µ5 250V 15mm; Manufacturer: Panasonic; PartNumber: ECQE2155KF; Other: Available; Value: 1µ5
C8 C46 = C-Cer 0805 1µ: as C23 on sheet Power; PackageReference: C0805; PackageDescription: Chip Capacitor; Value: 1µ; Supplier 1: Digi-Key; Supplier Part Number 1: 1276-1066-1-ND
C13 = C-Cer 0805 1n5: Cap Ceramic 0805 1n5 50V; Manufacturer: generic; Temp. Coeff.: X7R; PackageReference: C0805; PackageDescription: Chip Capacitor; Value: 1n5; PartNumber: generic
C14 = C-Cer 0805 3n3: as C32 on sheet Power; PackageReference: C0805; PackageDescription: Chip Capacitor; Value: 3n3; PartNumber: generic
C15 = C-Cer 1206 16V 10µ: as C21 on sheet Power; PackageReference: C1206; PackageDescription: Chip Capacitor; Value: 10µ; Supplier 1: Digi-Key; Supplier Part Number 1: 1276-6641-1-ND; Price [€]: 0,13
C45 = C-Cer 0805 1n: Cap Ceramic 0805 1n 50V; Manufacturer: generic; Temp. Coeff.: X7R; PackageReference: C0805; PackageDescription: Chip Capacitor; Value: 1n; PartNumber: generic
D1 D3-D5 = Diode 1.5SMC33CA: Diode, TVS, Bi, 33V, 33A, DO-214AB; Manufacturer: Littelfuse; Current: 33.3A; Notes: Available; Max. Voltage: 45.7V; ComponentLink1Description: Datasheet; ComponentLink1URL: G:\Daten\Datenblätter\Dioden\1_5SMC_TVS.pdf; PartNumber: 1.5SMC33CA; Value: 1.5SMC33CA
D2 = Diode Schottky 15A: Diode Schottky, 150V, 15A, TO-220-2; Manufacturer: SMC; PartNumber: 12TQ150; ComponentLink1Description: Datasheet; ComponentLink1URL: G:\Daten\Datenblätter\Dioden\12TQ150.pdf; Voltage: 150V; Current: 15A; Value: 12TQ150; Supplier 1: Digi-Key; Supplier Part Number 1: 1655-1002-ND; Price [€]: 0,61
F1 = Fuse w Holder 0031.8211 12A: Fuse w Holder 5x20mm 25mm 12A THT; Manufacturer: Schurter; Other: Sicherung: MTR. 10A; PartNumber: 0031.8211; Current: 12A; ComponentLink1URL: G:\Daten\Datenblätter\Sicherungen\Halter_15x20mm_Schurter_0031.82x1.pdf; ComponentLink1Description: Datasheet; Value: 12A; Size of Fuse: 5x20mm; ComponentLink2Description: Supplier; Supplier 1: Reichelt; Supplier Part Number 1: PL OGN-25; Price [€]: 0,44; ComponentLink2URL: https://www.reichelt.de/Sicherungshalter/PL-OGN-25/3/index.html?ACTION=3&GROUPID=7659&ARTICLE=35196&OFFSET=100&
FB1-FB3 = Ferrite Bead BLM21AG102SN1: Ferrite Bead 0805 1k 100MHz; Manufacturer: Murata; Current: 500mA; PartNumber: BLM21AG102SN1; Value: 1k; Frequency: 100MHz; ComponentLink1Description: Datasheet; ComponentLink1URL: G:\Daten\Datenblätter\Ferrite\BLM21AG102SN1.pdf; Supplier Part Number 1: BLM21AG 102; Supplier 1: Reichelt; ComponentLink2URL: https://www.reichelt.de/Filter/BLM21AG-102/3/index.html?ACTION=3&GROUPID=3175&ARTICLE=89684&OFFSET=75&; ComponentLink2Description: Supplier
HS1 = Mech Heat Sink CK960/20/SE: Mech Heat Sink CK960/20/SE TO-220; Unfertig; Manufacturer: Alutronic; Temp. Coeff.: 13 K/W; PartNumber: CK960/20/SE; DImensions: 20x20 mm; ComponentLink1Description: Datasheet; ComponentLink1URL: G:\Daten\Datenblätter\Kühlkörper\CK960-20-SE.pdf; Supplier Part Number 1: V CK960/20; Supplier 1: Reichelt
IC1 = Timer ICM7555IBA: Timer ICM7555 8-SOIC; Manufacturer: Intersil; PartNumber: ICM7555IBA; ComponentLink1Description: Datasheet; ComponentLink1URL: G:\Daten\Datenblätter\Timer\ICM755IBA.pdf; Value: ICM7555; Supplier Part Number 1: ICM 7555 IBAZ; Supplier 1: Reichelt
IC2 = LT1468: OpAmp LT1468 1x 90MHz; Manufacturer: Linear Technology; PartNumber: LT1468CS8; Value: LT1468; Price [€]: 7,05; ComponentLink1Description: Datasheet; ComponentLink1URL: G:\Daten\Datenblätter\Operationsverstärker\LT1468.pdf; Supplier 1: Reichelt; Supplier Part Number 1: LT 1468 CS8
IC3 = LM393DT: as IC3 on sheet Power; Value: LM393; PartNumber: LM393DT; Price [€]: 0,44; ComponentLink1Description: Datasheet; ComponentLink1URL: G:\Daten\Datenblätter\Komparatoren\ST_LM393.pdf; Supplier 1: Digi-Key; Supplier Part Number 1: 497-1593-1-ND; PartNumber_B: LM393DT
IC4 = TL072C: OpAmp TL072CD 2x JFET 3MHz; Manufacturer: Texas Instruments; Notes: Available; Value: TL072C; PartNumber: TL072CD; ComponentLink1Description: Datasheet; ComponentLink1URL: G:\Daten\Datenblätter\Operationsverstärker\TL072C.pdf
Q1 = Transistor n-MOS IXTK110N20L2: Transistor n-MOS, TO-264, 200V, THT; Manufacturer: IXYS; Note: Vgs_max = 20V; Current: 110A; PackageDescription: TO-264; ComponentLink1Description: Datasheet; ComponentLink1URL: G:\Daten\Datenblätter\Transistoren\nMOS_IXTK110N20L2.pdf; PartNumber: IXTK110N20L2; Value: IXTK110N20L2; Supplier 1: Digi-Key; Supplier Part Number 1: IXTK110N20L2-ND; Price [€]: 24,00
Q2-Q4 = Transistor n-MOS NDS355AN: as Q5 on sheet Power; PackageDescription: SOT-23; ComponentLink1Description: Datasheet; ComponentLink1URL: G:\Daten\Datenblätter\Transistoren\nMOS_NDS355AN.pdf; PartNumber: NDS355AN; Supplier 1: Digi-Key; Supplier Part Number 1: NDS355ANCT-ND; Price [€]: 0,39
R1 R11 R14 R20 = Res 0805 18k: as R26 on sheet Power; PartNumber: generic; Value: 18k
R2 = Res 0805 5k1: Resistor 0805 5k1; Manufacturer: generic; Power: 0.125W; PartNumber: generic; Value: 5k1
R3 = Res 0805 5k6: as R36 on sheet Power; PartNumber: generic; Value: 5k6
R4 = Res 0805 100R: Resistor 0805 100R; Manufacturer: generic; Power: 0.125W; PartNumber: generic; Value: 100R
R5 = Res 0805 6k8: as R34 on sheet Power; PartNumber: generic; Value: 6k8
R6 = Res 0805 39k: Resistor 0805 39k; Manufacturer: generic; Power: 0.125W; PartNumber: generic; Value: 39k
R7 = Pot 1k THT: Pot 1k THT 30 turns; Manufacturer: Suntan; PartNumber: TSR-3296-Y-102-R; Note: Available; Value: 1k; ComponentLink1Description: Datasheet; ComponentLink1URL: G:\Daten\Datenblätter\Potentiometer\TSR-3296.pdf
R8 = Res 0805 10R: Resistor 0805 10R; Manufacturer: generic; Power: 0.125W; Tolerance: 1%; PartNumber: generic; Value: 10R
R9 R16 = Res 0805 1k: Resistor 0805 1k; Manufacturer: generic; Power: 0.125W; PartNumber: generic; Value: 1k
R10 = Res 4-SIL 0R1: Resistor 4-SIL 0R1 0.5% 40W; Manufacturer: Riedon; PartNumber: PCS-0R1D1; Power: 40W; Value: 0R1; ComponentLink1URL: G:\Daten\Datenblätter\Widerstände\Riedon_PCS-PBV.pdf; ComponentLink1Description: Datasheet; Supplier 1: Digi-Key; Supplier Part Number 1: 696-1749-ND; Price [€]: 15,91; Tolerance: 0.5%
R12 = Res 0805 5M6: Resistor 0805 5M6; Manufacturer: generic; Power: 0.125W; PartNumber: generic; Value: 5M6
R13 = Res 0805 91k: Resistor 0805 91k; Manufacturer: generic; Power: 0.125W; PartNumber: generic; Value: 91k
R15 = Res 0805 1M8: Resistor 0805 1M8; Manufacturer: generic; Power: 0.125W; Voltage: 150V; PartNumber: generic; Value: 1M8
R17 R21 = Res 0805 200k: Resistor 0805 200k; Manufacturer: generic; Power: 0.125W; Voltage: 150V; PartNumber: generic; Value: 200k
R18 = Res 0805 1k8: as R49 on sheet Power; PartNumber: generic; Value: 1k8
R19 = Res 0805 2k: as R37 on sheet Power; PartNumber: generic; Value: 2k
R50 = Res 0805 15k: as R29 on sheet Power; PartNumber: generic; Value: 15k
TP1 = Test Point: SilkScreen: *
X1-X3 = Con Male 3-Pin: Connector, Male, Vertical, 3-Pin, 1mm, SMD; Manufacturer: SAMTEC; MatingPartNumber: S1SS-03-L; PartNumber: T1M-03-F-SV-L; Value: T1M-03-F-SV-L; Supplier Part Number 1: T1M-03-F-SV-L; Supplier 1: SAMTEC; ComponentLink1Description: Datasheet; ComponentLink1URL: G:\Daten\Datenblätter\Steckverbinder\T1M-Single-Row.pdf
X4 = Termial 2pin 5.08mm: as X5 on sheet Power; ComponentLink1Description: Reichelt URL; ComponentLink1URL: https://www.reichelt.de/RND-connect/RND-205-00287/3/index.html?ACTION=3&GROUPID=7552&ARTICLE=170288&OFFSET=16&; PartNumber: RND 205-00287; ComponentLink2Description: Datasheet; ComponentLink2URL: G:\Daten\Datenblätter\Verbinder\Terminal_RND_205-00287.pdf; Price [€]: 0,41; Supplier 1: Reichelt; Supplier Part Number 1: RND 205-00287

## Sheet TempCtrl.SchDoc: E-Last
size A3; DrawnBy: Sergej; Organization: ElektronikLabor; Revision: 1.1; SheetNumber: 4; SheetTotal: 4; Designer: ElektronikLabor; SchematicDate: 16.12.2019; SheetName: Over Temperature Protection; DocumentName: Temperature Protection
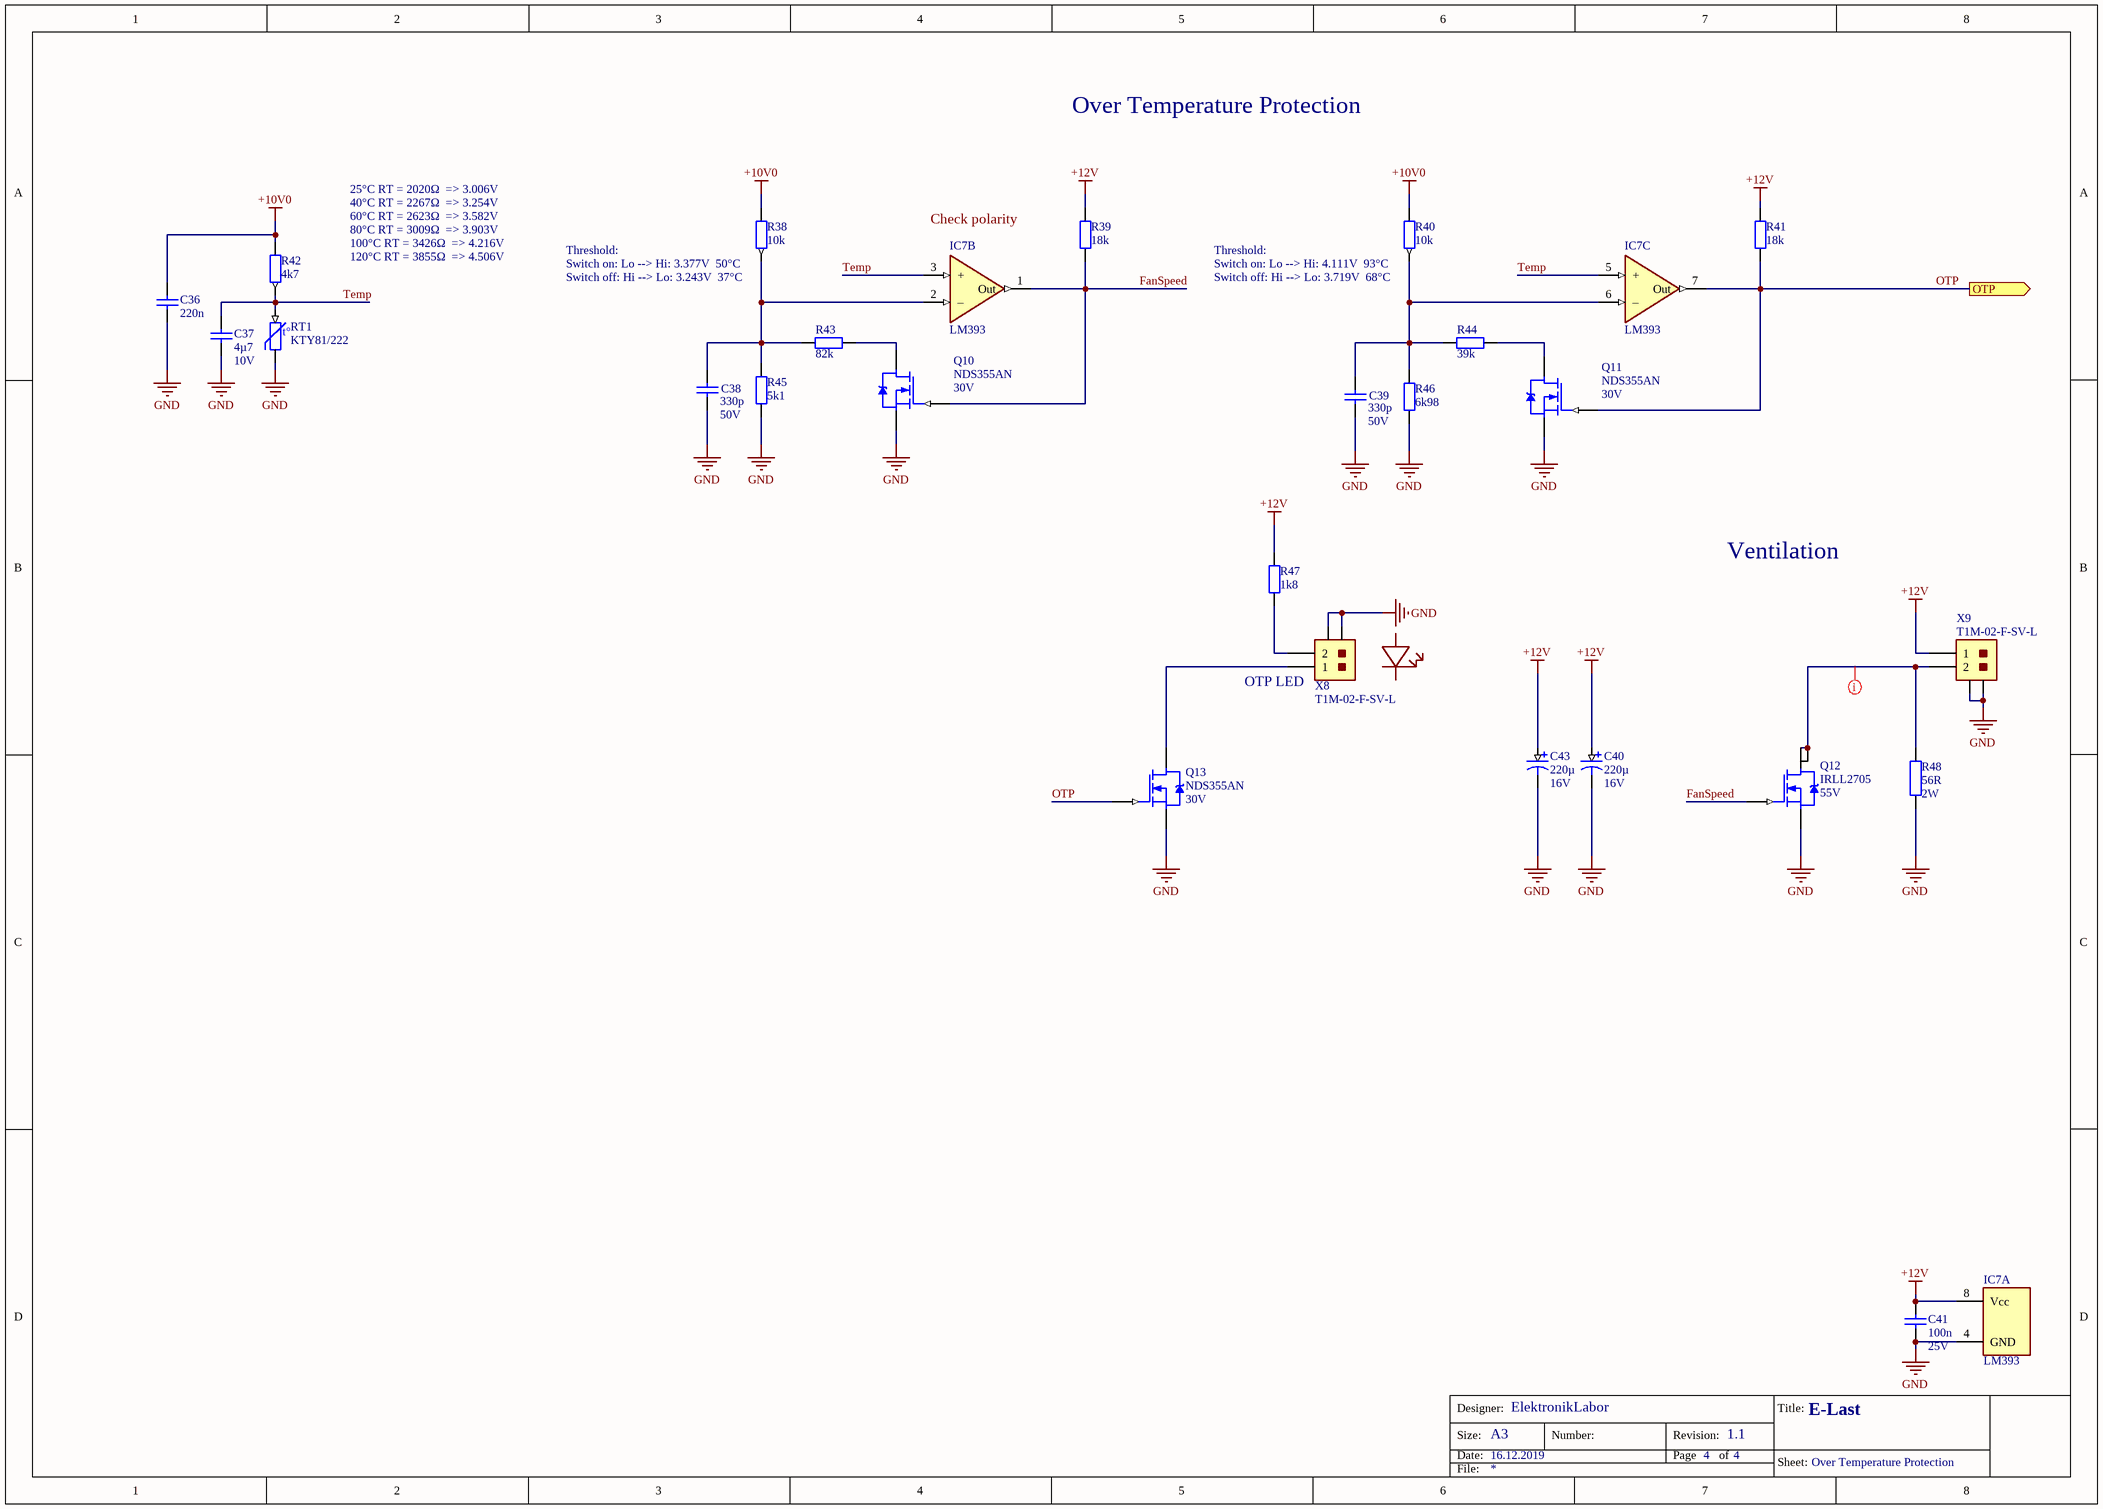
[diagram p3: TempCtrl.SchDoc]

### Parts
C36  220n  [C_0805]
C37  4µ7  Voltage: 10V  [C_0805]
C38  330p  Voltage: 50V  [C_0805]
C39  330p  Voltage: 50V  [C_0805]
C40  220µ  Voltage: 16V  [Cap Tantal E (2917)]
C41  100n  Voltage: 25V  [C_0805]
C43  220µ  Voltage: 16V  [Cap Tantal E (2917)]
IC7  LM393  [SOIC8_N]  (parts A,B,C of 3)
Q10  NDS355AN  Voltage: 30V  [SOT23_N - n-MOS]
Q11  NDS355AN  Voltage: 30V  [SOT23_N - n-MOS]
Q12  IRLL2705  Voltage: 55V  [SOT-223]
Q13  NDS355AN  Voltage: 30V  [SOT23_N - n-MOS]
R38  10k  [Res 0805]
R39  18k  [Res 0805]
R40  10k  [Res 0805]
R41  18k  [Res 0805]
R42  4k7  [Res 0805]
R43  82k  [Res 0805]
R44  39k  [Res 0805]
R45  5k1  [Res 0805]
R46  6k98  [Res 0805]
R47  1k8  [Res 0805]
R48  56R  Power: 2W  [RES PO593-0 vert]
RT1  KTY81/222  [TO-92-2]
X8  T1M-02-F-SV-L  [T1M-02-XX-S-V]
X9  T1M-02-F-SV-L  [T1M-02-XX-S-V]

### Ports
OTP (out)

### Nets
+10V0: C36.1 R38.1 R40.1 R42.1
+12V: C40.1 C41.1 C43.1 IC7.8(Vcc) R39.1 R41.1 R47.1 X9.1
GND: C36.2 C37.2 C38.2 C39.2 C40.2 C41.2 C43.2 IC7.4(GND) Q10.2(S) Q11.2(S) Q12.3(S) Q13.2(S) R45.2 R46.2 R48.2 RT1.1 X8.3(CASE) X8.4(CASE) X9.3(CASE) X9.4(CASE)
FanSpeed: IC7.1(Out) Q10.1(G) Q12.1(G) R39.2
OTP: IC7.7(Out) Q11.1(G) Q13.1(G) R41.2 ; port OTP
Temp: C37.1 IC7.3(+) IC7.5(+) R42.2 RT1.2
NetC38_1: C38.1 IC7.2(–) R38.2 R43.1 R45.1
NetC39_1: C39.1 IC7.6(–) R40.2 R44.1 R46.1
NetQ10_3: Q10.3(D) R43.2
NetQ11_3: Q11.3(D) R44.2
NetQ12_2: Q12.2(D) Q12.4(D) R48.1 X9.2
NetQ13_3: Q13.3(D) X8.1
NetR47_2: R47.2 X8.2

### Layout directives
rule Width Constraint [Pref Width = 2mm    Min Width = 1mm    Max Width = 2mm]: NetQ12_2

### Notes on the sheet
- Over Temperature Protection
- Check polarity
- 25°C	RT = 2020Ω  => 3.006V
  40°C	RT = 2267Ω  => 3.254V
  60°C	RT = 2623Ω  => 3.582V
  80°C	RT = 3009Ω  => 3.903V
  100°C	RT = 3426Ω  => 4.216V
  120°C	RT = 3855Ω  => 4.506V
- (near R38) Threshold:
  Switch on: Lo --> Hi: 3.377V  50°C
  Switch off: Hi --> Lo: 3.243V  37°C
- (near R40) Threshold:
  Switch on: Lo --> Hi: 4.111V  93°C
  Switch off: Hi --> Lo: 3.719V  68°C
- Ventilation
- (near X8) OTP LED
- Size:
- Date:
- Designer:
- A3
- Number:
- Revision:
- Page
- of
- Title:
- File:
- Sheet:
- (in symbol KTY81/222) t°

### Library data of the parts
C36 = C-Cer 0805 220n: as C2 on sheet Analog; PackageReference: C0805; PackageDescription: Chip Capacitor; Value: 220n; PartNumber: generic; Voltage: 50V
C37 = C-Cer 0805 4µ7: Cap Ceramic 0805 4µ7 10V; Manufacturer: generic; Temp. Coeff.: X5R; PackageReference: C0805; PackageDescription: Chip Capacitor; Value: 4µ7; PartNumber: generic
C38 C39 = C-Cer 0805 330p: as C4 on sheet Analog; PackageReference: C0805; PackageDescription: Chip Capacitor; Value: 330p; PartNumber: generic; Price [€]: 0,18
C40 C43 = Cap Tantal 220µ: as C22 on sheet Power; Value: 220µ; ComponentLink1Description: Datasheet; ComponentLink1URL: G:\Daten\Datenblätter\Kondensatoren\AVX_Tantal_TPS.pdf; Supplier Part Number 1: TPS 7343 220/16; Supplier 1: Reichelt; Price [€]: 1,15
C41 = C-Cer 0805 100n: as C27 on sheet Power; PackageReference: C_0805; PackageDescription: Chip Capacitor; Value: 100n; PartNumber: generic
IC7 = LM393DT: as IC3 on sheet Power; Value: LM393; PartNumber: LM393DT; Price [€]: 0,44; ComponentLink1Description: Datasheet; ComponentLink1URL: G:\Daten\Datenblätter\Komparatoren\ST_LM393.pdf; Supplier 1: Digi-Key; Supplier Part Number 1: 497-1593-1-ND; PartNumber_B: LM393DT
Q10 Q11 Q13 = Transistor n-MOS NDS355AN: as Q5 on sheet Power; PackageDescription: SOT-23; ComponentLink1Description: Datasheet; ComponentLink1URL: G:\Daten\Datenblätter\Transistoren\nMOS_NDS355AN.pdf; PartNumber: NDS355AN; Supplier 1: Digi-Key; Supplier Part Number 1: NDS355ANCT-ND; Price [€]: 0,39
Q12 = Transistor n-MOS IRLL2705: Transistor n-MOS SOT-223 55V Vgs=16V; Manufacturer: International Rectifier; PartNumber: IRLL2705PbF; Note: Vgs_max = 16V; Current: 3.8A; PackageDescription: SOT-223; ComponentLink1Description: Datasheet; ComponentLink1URL: G:\Daten\Datenblätter\Transistoren\nMOS_IRLL2705.pdf; Price [€]: 0,44; Supplier 1: Reichelt; Supplier Part Number 1: IRLL 2705; Value: IRLL2705; ComponentLink2URL: https://www.reichelt.de/IRL-IRFZ-Transistoren/IRLL-2705/3/index.html?ACTION=3&GROUPID=2896&ARTICLE=129817&OFFSET=75&; ComponentLink2Description: Supplier
R38 R40 = Res 0805 10k: Resistor 0805 10k; Manufacturer: generic; Power: 0.125W; PartNumber: generic; Value: 10k
R39 R41 = Res 0805 18k: as R26 on sheet Power; PartNumber: generic; Value: 18k
R42 = Res 0805 4k7: as R30 on sheet Power; PartNumber: generic; Value: 4k7
R43 = Res 0805 82k: Resistor 0805 82k; Manufacturer: generic; Power: 0.125W; PartNumber: generic; Value: 82k
R44 = Res 0805 39k: as R6 on sheet Analog; PartNumber: generic; Value: 39k
R45 = Res 0805 5k1: as R2 on sheet Analog; PartNumber: generic; Value: 5k1
R46 = Res 0805 6k98: Resistor 0805 6k98; Manufacturer: generic; Power: 0.125W; PartNumber: generic; Value: 6k98
R47 = Res 0805 1k8: as R49 on sheet Power; PartNumber: generic; Value: 1k8
R48 = Res Power 56R: Resistor 56R 2W THT; Manufacturer: VITROHM; PartNumber: PO593-0 5 T 56R; Value: 56R; ComponentLink1URL: G:\Daten\Datenblätter\Widerstände\VITROHM_series_PO.pdf; ComponentLink1Description: Datasheet; ComponentLink2URL: https://www.reichelt.de/2W-Metall-1-0-Ohm-820-Ohm/2W-METALL-56/3/index.html?ACTION=3&GROUPID=3083&ARTICLE=2359&OFFSET=75&; ComponentLink2Description: Supplier; Supplier Part Number 1: 2W METALL 56; Supplier 1: Reichelt; Price [€]: 0,11
RT1 = KTY81/222: Sensor Temp 2k TO92-2; Manufacturer: NXP; PartNumber: KTY81/222; Value: 2k; ComponentLink1URL: G:\Daten\Datenblätter\Sensoren\KTY81.pdf; ComponentLink1Description: Datasheet; Supplier Part Number 1: 181048 - 62; Supplier 1: Conrad; Price [€]: 2,05; Package: TO92-2
X8 X9 = Con Male 2-Pin: Connector, Male, Vertical, 2-Pin, 1mm, SMD; Manufacturer: SAMTEC; MatingPartNumber: S1SS-02-L; PartNumber: T1M-02-F-SV-L; Value: T1M-02-F-SV-L; Supplier Part Number 1: T1M-02-F-SV-L; Supplier 1: SAMTEC; ComponentLink1Description: Datasheet; ComponentLink1URL: G:\Daten\Datenblätter\Steckverbinder\T1M-Single-Row.pdf

## Nets that join several sheets
+9V: Power (5 pins), Analog (7 pins)
+10V0: Power (7 pins), Analog (C2.1 R13.1 X2.2), TempCtrl (C36.1 R38.1 R40.1 R42.1)
+12V: Power (17 pins), Analog (C18.2 IC4.8 R14.1), TempCtrl (8 pins)
-3V: Power (5 pins), Analog (6 pins)
GND: Main (MH1.1 MH3.1 MH5.1), Power (46 pins), Analog (36 pins), TempCtrl (20 pins)
NetIC4_1: Power (X7.1), Analog (IC4.1 R20.2)
NetQ4_1: Power (Q9.1), Analog (Q4.1 R16.2)
OTP: Analog (Q3.1), TempCtrl (IC7.7 Q11.1 Q13.1 R41.2)
Vin: Power (IC3.2 R49.2), Analog (IC4.7 R21.2)